# Altium project HeadControllerATMEL.PrjPcb
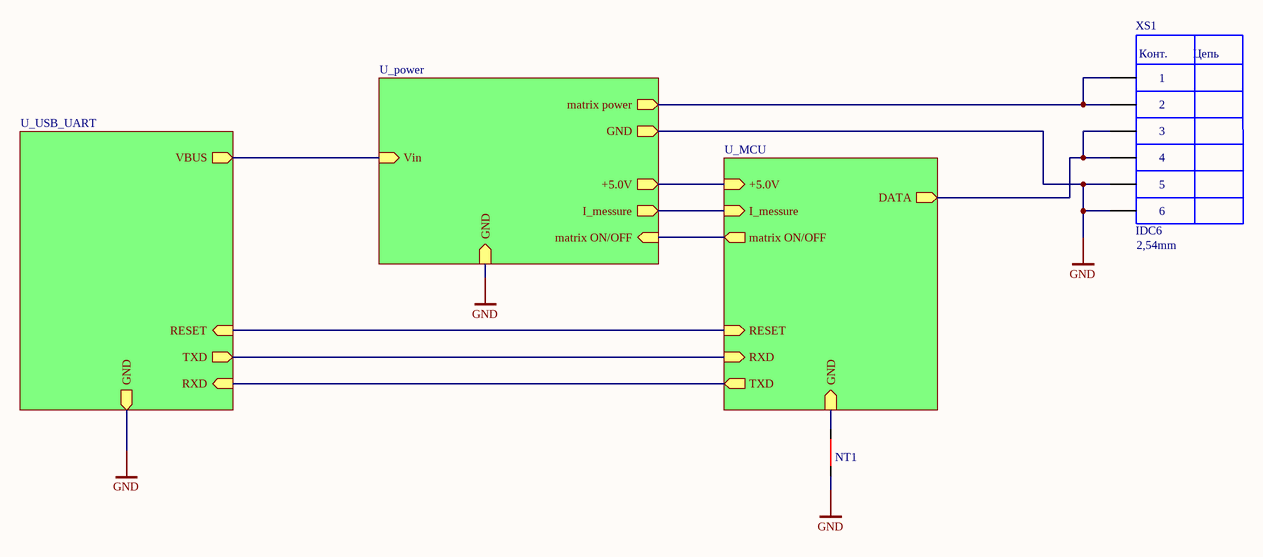
[diagram p0: HeadController.SchDoc]
4 sheets, 64 parts. Net scope: hierarchical (ports join the sheet entries above them; power ports are global).
Board file: HeadControllerATMEL_1.PcbDoc
Sheets:
  HeadController.SchDoc
    U_MCU = MCU.SchDoc
    U_power = power.SchDoc
    U_USB_UART = USB_UART.SchDoc

## Sheet HeadController.SchDoc
size A4

### Parts
NT1  (no value)  [NT]  (net tie, no BOM)
XS1  IDC6  Package: 2,54mm  [IDC-6 (2.54) (end face)]

### Sub-sheets
U_MCU = MCU.SchDoc: GND (in), +5.0V (in), RXD (in), TXD (out), I_messure (in), matrix ON/OFF (out), DATA (out), RESET (in)
U_power = power.SchDoc: +5.0V (out), Vin (in), I_messure (out), matrix ON/OFF (in), matrix power (out), GND (out), GND (in)
U_USB_UART = USB_UART.SchDoc: TXD (out), RXD (in), VBUS (out), GND (out), RESET (in)

### Nets
GND: NT1.2 XS1.5 XS1.6 ; sheet U_power/GND, sheet U_power/GND, sheet U_USB_UART/GND
MCU_GND: NT1.1 ; sheet U_MCU/GND
MCU_VCC: sheet U_MCU/+5.0V, sheet U_power/+5.0V
VBUS: sheet U_power/Vin, sheet U_USB_UART/VBUS
M_ON/OFF: sheet U_MCU/matrix ON/OFF, sheet U_power/matrix ON/OFF
NetC5_2: sheet U_MCU/RESET, sheet U_USB_UART/RESET
NetDD1_23: sheet U_MCU/I_messure, sheet U_power/I_messure
NetDD1_30: sheet U_MCU/RXD, sheet U_USB_UART/TXD
NetDD1_31: sheet U_MCU/TXD, sheet U_USB_UART/RXD
NetR20_2: XS1.3 XS1.4 ; sheet U_MCU/DATA
NetVT2_3: XS1.1 XS1.2 ; sheet U_power/matrix power

### Notes on the sheet
- (in symbol IDC6) Конт.; Цепь

### Library data of the parts
NT1 = NT
XS1 = IDC6: ValueBOM: Разъём IDC6 прямой; Type: XS; Value: IDC6

## Sheet MCU.SchDoc
size A3
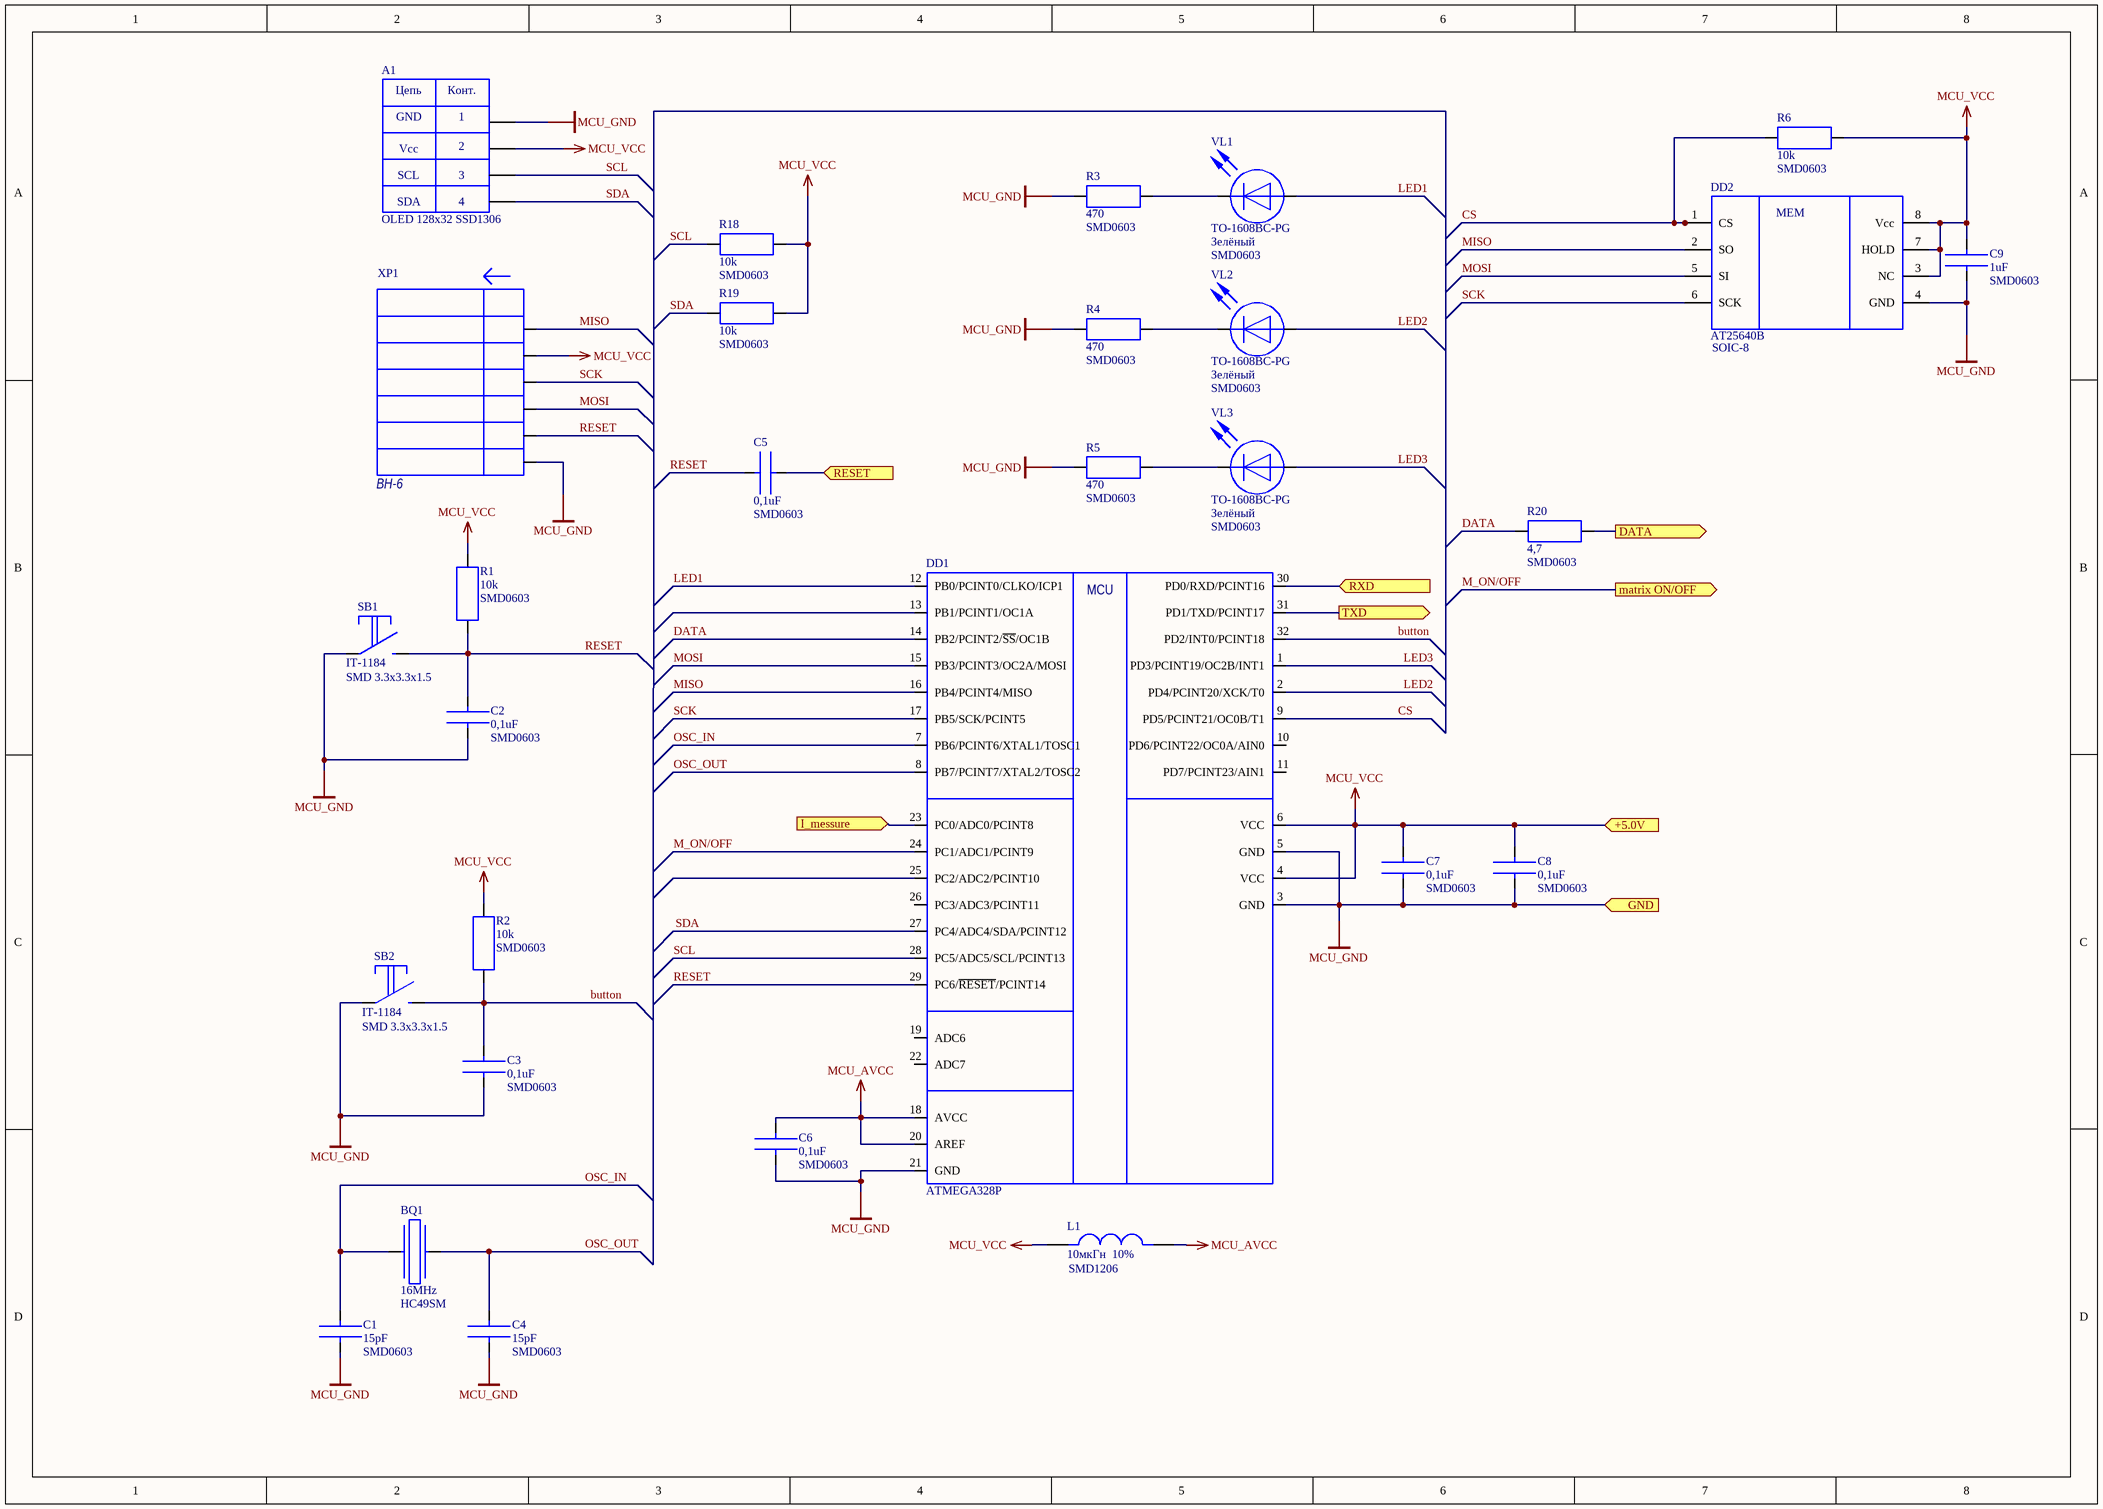
[diagram p1: MCU.SchDoc]

### Parts
A1  OLED 128x32 SSD1306  [OLED 128x32]
BQ1  16МHz  Package: HC49SM  [BQ_HC49SM]
C1  15pF  Package: SMD0603  [SMD0603(1005)]
C2  0,1uF  Package: SMD0603  [SMD0603(1005)]
C3  0,1uF  Package: SMD0603  [SMD0603(1005)]
C4  15pF  Package: SMD0603  [SMD0603(1005)]
C5  0,1uF  Package: SMD0603  [SMD0603(1005)]
C6  0,1uF  Package: SMD0603  [SMD0603(1005)]
C7  0,1uF  Package: SMD0603  [SMD0603(1005)]
C8  0,1uF  Package: SMD0603  [SMD0603(1005)]
C9  1uF  Package: SMD0603  [SMD0603(1005)]
DD1  ATMEGA328P  [TQFP-32]
DD2  AT25640B  Package: SOIC-8  [SOIC8]
L1  10мкГн  10%  Package: SMD1206  [SMD1206(3216)]
R1  10k  Package: SMD0603  [SMD0603(1005)]
R2  10k  Package: SMD0603  [SMD0603(1005)]
R3  470  Package: SMD0603  [SMD0603(1005)]
R4  470  Package: SMD0603  [SMD0603(1005)]
R5  470  Package: SMD0603  [SMD0603(1005)]
R6  10k  Package: SMD0603  [SMD0603(1005)]
R18  10k  Package: SMD0603  [SMD0603(1005)]
R19  10k  Package: SMD0603  [SMD0603(1005)]
R20  4,7  Package: SMD0603  [SMD0603(1005)]
SB1  IT-1184  Package: SMD 3.3x3.3x1.5  [IT-1184]
SB2  IT-1184  Package: SMD 3.3x3.3x1.5  [IT-1184]
VL1  TO-1608BC-PG  Light: Зелёный  Package: SMD0603  [LED_SMD0603(1005)]
VL2  TO-1608BC-PG  Light: Зелёный  Package: SMD0603  [LED_SMD0603(1005)]
VL3  TO-1608BC-PG  Light: Зелёный  Package: SMD0603  [LED_SMD0603(1005)]
XP1  BH-6  [IDC-6 (2.54)]

### Ports
+5.0V (in), DATA (out), GND (in), I_messure (in), matrix ON/OFF (out), RESET (in), RXD (in), TXD (out)

### Nets
MCU_AVCC: C6.1 DD1.18(AVCC) DD1.20(AREF) L1.2(IN1)
MCU_GND: A1.1(+5) C1.1 C2.2 C3.2 C4.1 C6.2 C7.2 C8.1 C9.2 DD1.3(GND) DD1.5(GND) DD1.21(GND) DD2.4(GND) R3.2 R4.2 R5.2 SB1.1 SB2.1 XP1.6 ; port GND
MCU_VCC: A1.2(DM-) C7.1 C8.2 C9.1 DD1.4(VCC) DD1.6(VCC) DD2.3(NC) DD2.7(HOLD) DD2.8(Vcc) L1.1(IN1) R1.2 R2.2 R6.2 R18.1 R19.1 XP1.2 ; port +5.0V
button: C3.1 DD1.32(PD2/INT0/PCINT18) R2.1 SB2.2
CS: DD1.9(PD5/PCINT21/OC0B/T1) DD2.1(CS) R6.1
DATA: DD1.14(PB2/PCINT2/~{SS}/OC1B) R20.1
LED1: DD1.12(PB0/PCINT0/CLKO/ICP1) VL1.1
LED2: DD1.2(PD4/PCINT20/XCK/T0) VL2.1
LED3: DD1.1(PD3/PCINT19/OC2B/INT1) VL3.1
M_ON/OFF: DD1.24(PC1/ADC1/PCINT9) ; port matrix ON/OFF
MISO: DD1.16(PB4/PCINT4/MISO) DD2.2(SO) XP1.1
MOSI: DD1.15(PB3/PCINT3/OC2A/MOSI) DD2.5(SI) XP1.4
OSC_IN: BQ1.1 C1.2 DD1.7(PB6/PCINT6/XTAL1/TOSC1)
OSC_OUT: BQ1.2 C4.2 DD1.8(PB7/PCINT7/XTAL2/TOSC2)
RESET: C2.1 C5.1 DD1.29(PC6/~{RESET}/PCINT14) R1.1 SB1.2 XP1.5
SCK: DD1.17(PB5/SCK/PCINT5) DD2.6(SCK) XP1.3
SCL: A1.3(DM-) DD1.28(PC5/ADC5/SCL/PCINT13) R18.2
SDA: A1.4(DM-) DD1.27(PC4/ADC4/SDA/PCINT12) R19.2
NetC5_2: C5.2 ; port RESET
NetDD1_23: DD1.23(PC0/ADC0/PCINT8) ; port I_messure
NetDD1_30: DD1.30(PD0/RXD/PCINT16) ; port RXD
NetDD1_31: DD1.31(PD1/TXD/PCINT17) ; port TXD
NetR3_1: R3.1 VL1.2
NetR4_1: R4.1 VL2.2
NetR5_1: R5.1 VL3.2
NetR20_2: R20.2 ; port DATA

Not connected (* = marked no-connect by the designer): DD1 10(PD6/PCINT22/OC0A/AIN0) 11(PD7/PCINT23/AIN1) 13(PB1/PCINT1/OC1A) 19(ADC6) 22(ADC7) 25(PC2/ADC2/PCINT10) 26(PC3/ADC3/PCINT11)

### Notes on the sheet
- Title
- Size:
- Date:
- A3
- Number:
- Time:
- Revision:
- Sheet
- of
- File:
- (in symbol ATMEGA168V-10AU) MCU
- (in symbol OLED) Цепь; Конт.; GND; Vcc; SCL; SDA
- (in symbol Микросхема AT25640B) MEM

### Library data of the parts
A1 = OLED: ValueBOM: Дисплей OLED-дисплей 0.91-дюймовый, белый, ЖК дисплей 128 * 32, на SSD1306, модуль для Arduino, интерфейс I2C IIC; Type: A; Value: OLED 128x32 SSD1306
BQ1 = BQ_HC49SM: ValueBOM: Кварцевый резонатор 16МГц HC49S; Type: BQ; Value: 16МHz
C1 C4 = CER_CUP_0603: Type: C; ValueBOM: Конденсатор керамический 15пФ SMD 0603 1%; Value: 15pF
C2 C3 C5-C8 = CER_CUP_0603: Type: C; ValueBOM: Конденсатор керамический 0,1мкФ SMD 0603 1%; Value: 0,1uF
C9 = CER_CUP_0603: Type: C; ValueBOM: Конденсатор керамический 1мкФ SMD 0603 1%; Value: 1uF
DD1 = ATMEGA168V-10AU: Microcontroller; Vendor: Atmel; ValueBOM: Микроконтроллер ATMEGA328P; GlobalLink: ATMEGA168V-10AU; Type: DD; Value: ATMEGA328P; Vendor P/N: ATMEGA168V-10AU; Package: TQFP-32; Package Description: JEDEC reference MS-026, Variation ABA
DD2 = Микросхема AT25640B: ValueBOM: Микросхема EEPROM AT25640B; Value: AT25640B; Type: DD
L1 = L1: ValueBOM: Индуктивность 10 мкГн, SMD1206, 10%; Type: L; Value: 10мкГн  10%
R1 R2 R6 R18 R19 = R_0603: ValueBOM: Резистор 10кОм SMD 0603 1%; Type: R; Value: 10k
R3-R5 = R_0603: ValueBOM: Резистор 470 Ом SMD 0603 1%; Type: R; Value: 470
R20 = R_0603: ValueBOM: Резистор 4,7Ом SMD 0603 1%; Type: R; Value: 4,7
SB1 SB2 = Кнопка тактовая (универсальная): ValueBOM: Кнопка тактовая IT1184; Type: SB; Value: IT-1184
VL1-VL3 = LED_0603: ValueBOM: Светодиод зелёный TO-1608BC-PG SMD0603; Type: VL; Value: TO-1608BC-PG
XP1 = ISP_HEADER: ValueBOM: Разъем BH-6 вилка 6 контактов (2х3), на плату, шаг 2.54мм; GlobalLink: ISP_HEADER; Type: XP; Value: BH-6; Package: DIL-6

## Sheet power.SchDoc
size A4
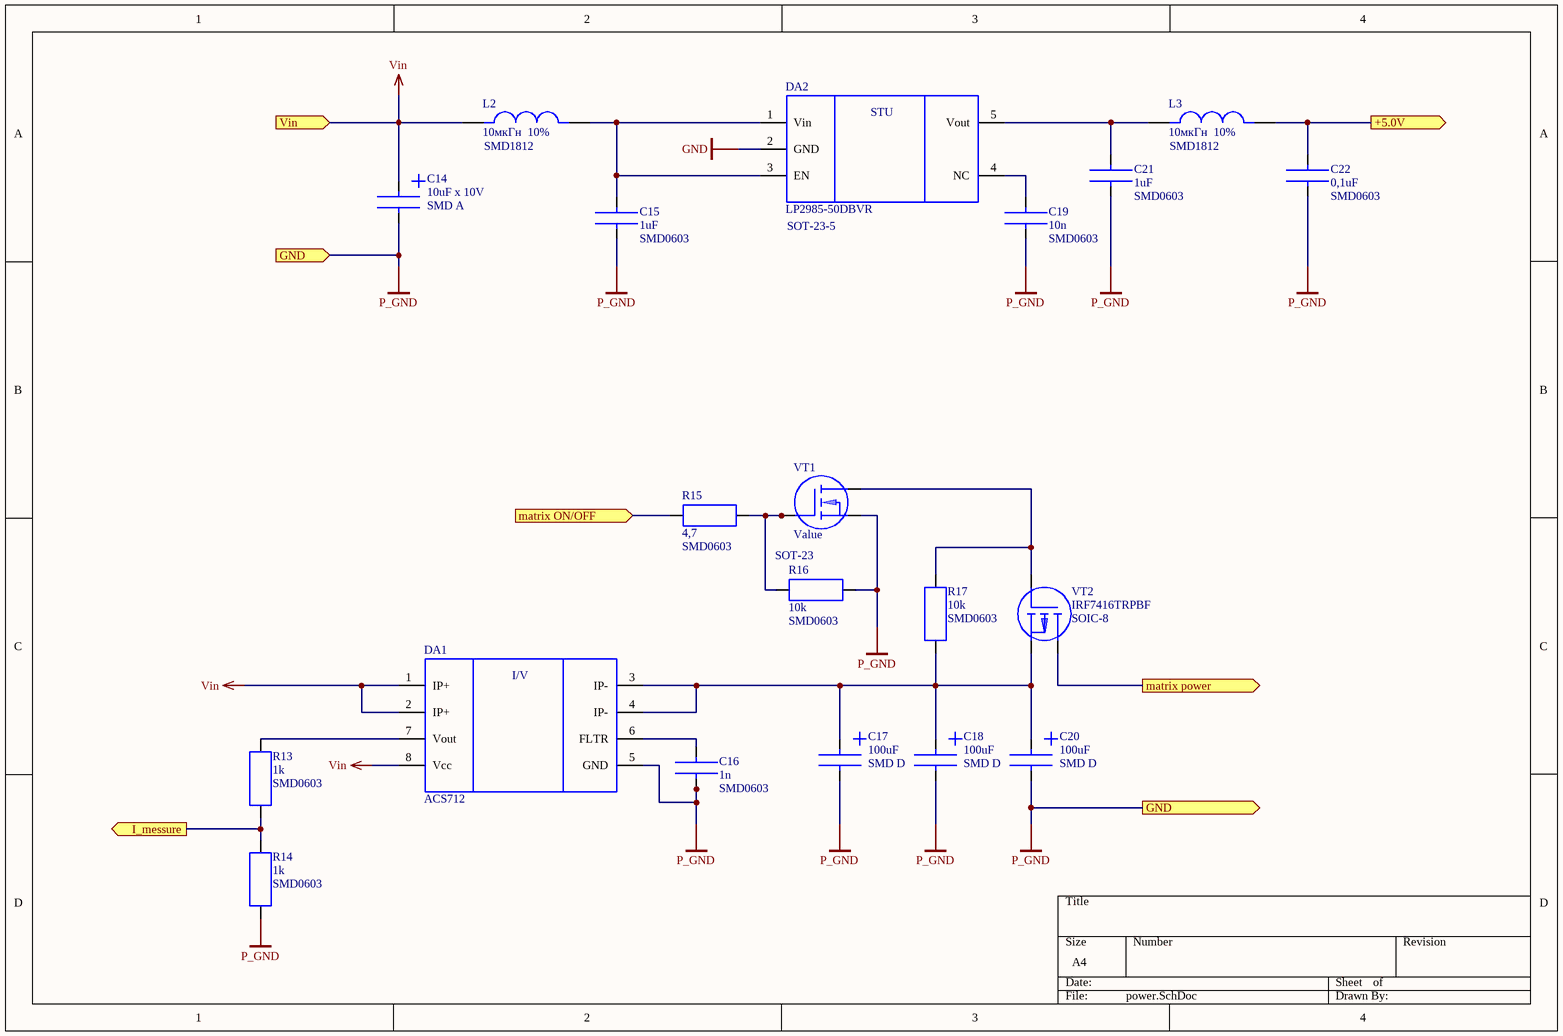
[diagram p2: power.SchDoc]

### Parts
C14  10uF x 10V  Package: SMD A  [TANT_CAP_A(3216)]
C15  1uF  Package: SMD0603  [SMD0603(1005)]
C16  1n  Package: SMD0603  [SMD0603(1005)]
C17  100uF  Package: SMD D  [TANT_CAP_D(7343)]
C18  100uF  Package: SMD D  [TANT_CAP_D(7343)]
C19  10n  Package: SMD0603  [SMD0603(1005)]
C20  100uF  Package: SMD D  [TANT_CAP_D(7343)]
C21  1uF  Package: SMD0603  [SMD0603(1005)]
C22  0,1uF  Package: SMD0603  [SMD0603(1005)]
DA1  ACS712  [SOIC8]
DA2  LP2985-50DBVR  Package: SOT-23-5  [SOT23-5]
L2  10мкГн  10%  Package: SMD1812  [SMD2010(5025)]
L3  10мкГн  10%  Package: SMD1812  [SMD2010(5025)]
R13  1k  Package: SMD0603  [SMD0603(1005)]
R14  1k  Package: SMD0603  [SMD0603(1005)]
R15  4,7  Package: SMD0603  [SMD0603(1005)]
R16  10k  Package: SMD0603  [SMD0603(1005)]
R17  10k  Package: SMD0603  [SMD0603(1005)]
VT1  Value  Package: SOT-23  [SOT23-3]
VT2  IRF7416TRPBF  Package: SOIC-8  [VT_SOIC8]

### Ports
+5.0V (out), GND (in), GND (out), I_messure (out), matrix ON/OFF (in), matrix power (out), Vin (in)

### Nets
GND: C14.2 C15.2 C16.2 C17.2 C18.2 C19.2 C20.2 C21.2 C22.2 DA1.5(GND) DA2.2(GND) R14.2 R16.2 VT1.2 ; port GND  [also labelled P_GND]
MCU_VCC: C22.1 L3.2(IN1) ; port +5.0V
Vin: C14.1 DA1.1(IP+) DA1.2(IP+) DA1.8(Vcc) L2.1(IN1) ; port Vin  [project net VBUS]
M_ON/OFF: R15.1 ; port matrix ON/OFF
NetC15_1: C15.1 DA2.1(Vin) DA2.3(EN) L2.2(IN1)
NetC16_1: C16.1 DA1.6(FLTR)
NetC17_1: C17.1 C18.1 C20.1 DA1.3(IP-) DA1.4(IP-) R17.2 VT2.1
NetC19_1: C19.1 DA2.4(NC)
NetC21_1: C21.1 DA2.5(Vout) L3.1(IN1)
NetDA1_7: DA1.7(Vout) R13.1
NetDD1_23: R13.2 R14.1 ; port I_messure
NetR15_2: R15.2 R16.1 VT1.1
NetR17_1: R17.1 VT1.3 VT2.2
NetVT2_3: VT2.3 ; port matrix power

### Notes on the sheet
- (in symbol LD3985M33R) STU
- (in symbol Микросхема ACS712) I/V

### Library data of the parts
C14 = C_TANT_A: Type: C; ValueBOM: Конденсатор танталовый 10мкФ х 10В SMD A; Value: 10uF x 10V
C15 C21 = CER_CUP_0603: as C9 on sheet MCU; Value: 1uF
C16 = CER_CUP_0603: Type: C; ValueBOM: Конденсатор керамический 1нФ х 50В SMD 0603 1%; Value: 1n
C17 C18 C20 = C_TANT_D: Type: C; ValueBOM: Конденсатор танталовый 100мкФ х 16В 10%  SMD D; Value: 100uF
C19 = CER_CUP_0603: Type: C; ValueBOM: Конденсатор керамический 10нФ х 50В SMD 0603 1%; Value: 10n
C22 = CER_CUP_0603: as C2 on sheet MCU; Value: 0,1uF
DA1 = Микросхема ACS712: Value: ACS712; Type: DA; ValueBOM: Микросхема ACS712
DA2 = LD3985M33R: ValueBOM: Микросхема LP2985-50DBVR, SOT-23-5; Value: LP2985-50DBVR; Type: DA
L2 L3 = L1: ValueBOM: Индуктивность B82432-C1103-K, 10 мкГн, SMD1812, 10%; Type: L; Value: 10мкГн  10%
R13 R14 = R_0603: ValueBOM: Резистор 1кОм SMD 0603 1%; Type: R; Value: 1k
R15 = R_0603: ValueBOM: Резистор 4,7Ом SMD 0603 1%; Type: R; Value: 4,7
R16 R17 = R_0603: ValueBOM: Резистор 10кОм SMD 0603 1%; Type: R; Value: 10k
VT1 = VT_N_MOSFET_SOT23_3: Type: VT; ValueBOM: Транзистор n-МОП Value SOT23; Value: Value
VT2 = Транзистор IRF7416TRPBF: Type: VT; ValueBOM: Транзистор p-МОП IRF7416TRPBF, SOIC-8; Value: IRF7416TRPBF

## Sheet USB_UART.SchDoc
size A4
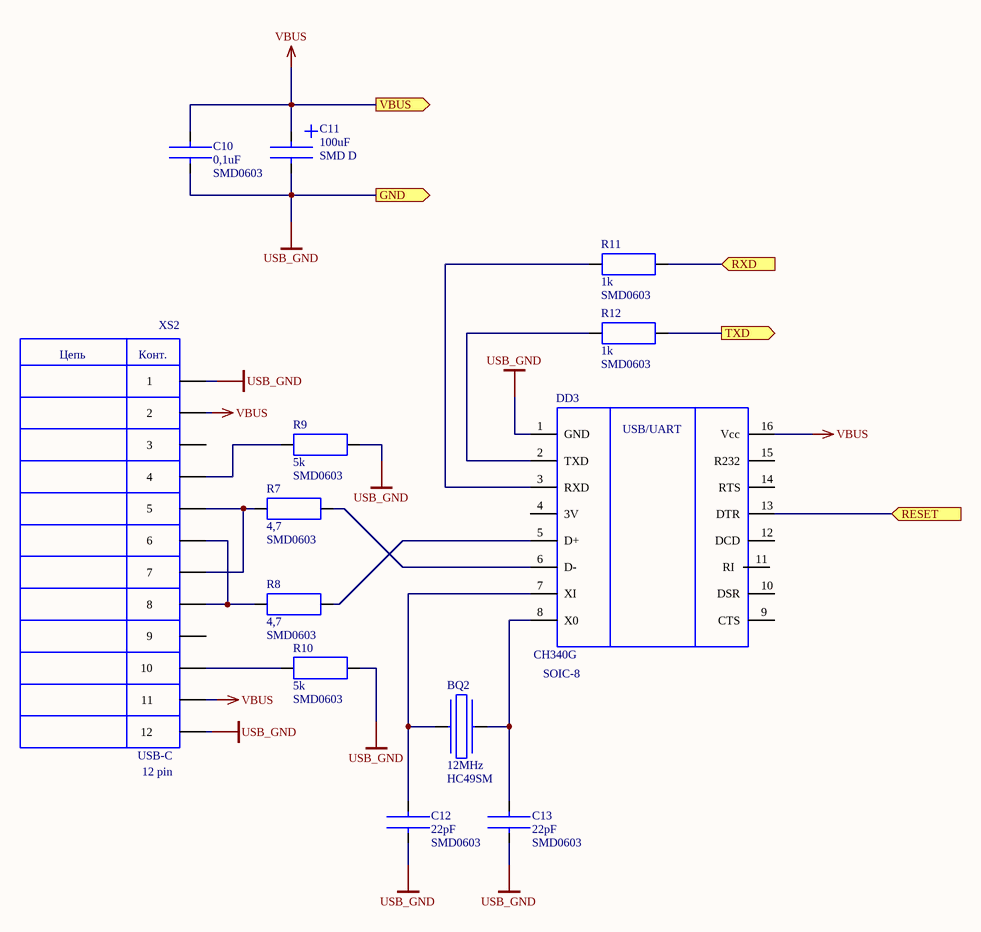
[diagram p3: USB_UART.SchDoc]

### Parts
BQ2  12МHz  Package: HC49SM  [BQ_HC49SM]
C10  0,1uF  Package: SMD0603  [SMD0603(1005)]
C11  100uF  Package: SMD D  [TANT_CAP_D(7343)]
C12  22pF  Package: SMD0603  [SMD0603(1005)]
C13  22pF  Package: SMD0603  [SMD0603(1005)]
DD3  CH340G  Package: SOIC-8  [SOIC16]
R7  4,7  Package: SMD0603  [SMD0603(1005)]
R8  4,7  Package: SMD0603  [SMD0603(1005)]
R9  5k  Package: SMD0603  [SMD0603(1005)]
R10  5k  Package: SMD0603  [SMD0603(1005)]
R11  1k  Package: SMD0603  [SMD0603(1005)]
R12  1k  Package: SMD0603  [SMD0603(1005)]
XS2  USB-C  Package: 12 pin  [USB_C]

### Ports
GND (out), RESET (in), RXD (in), TXD (out), VBUS (out)

### Nets
USB_GND: C10.1 C11.2 C12.1 C13.1 DD3.1(GND) R9.1 R10.1 XS2.1 XS2.12 ; port GND  [project net GND]
VBUS: C10.2 C11.1 DD3.16(Vcc) XS2.2 XS2.11 ; port VBUS
NetBQ2_1: BQ2.1 C12.2 DD3.7(XI)
NetBQ2_2: BQ2.2 C13.2 DD3.8(X0)
NetC5_2: DD3.13(DTR) ; port RESET
NetDD1_30: R12.1 ; port TXD
NetDD1_31: R11.1 ; port RXD
NetDD3_2: DD3.2(TXD) R12.2
NetDD3_3: DD3.3(RXD) R11.2
NetDD3_5: DD3.5(D+) R8.2
NetDD3_6: DD3.6(D-) R7.2
NetR7_1: R7.1 XS2.5 XS2.7
NetR8_1: R8.1 XS2.6 XS2.8
NetR9_2: R9.2 XS2.4
NetR10_2: R10.2 XS2.10

Not connected (* = marked no-connect by the designer): DD3 4(3V) 9(CTS) 10(DSR) 11(RI) 12(DCD) 14(RTS) 15(R232); XS2 3 9

### Notes on the sheet
- (in symbol USB_C) Цепь; Конт.
- (in symbol Микросхема CH340G) USB/UART

### Library data of the parts
BQ2 = BQ_HC49SM: ValueBOM: Кварцевый резонатор 12МГц HC49S; Type: BQ; Value: 12МHz
C10 = CER_CUP_0603: as C2 on sheet MCU; Value: 0,1uF
C11 = C_TANT_D: as C17 on sheet power; Value: 100uF
C12 C13 = CER_CUP_0603: Type: C; ValueBOM: Конденсатор керамический 22пФ SMD 0603 1%; Value: 22pF
DD3 = Микросхема CH340G: Type: DD; Value: CH340G; ValueBOM: Микросхема CH340G
R7 R8 = R_0603: ValueBOM: Резистор 4,7Ом SMD 0603 1%; Type: R; Value: 4,7
R9 R10 = R_0603: ValueBOM: Резистор 5кОм SMD 0603 1%; Type: R; Value: 5k
R11 R12 = R_0603: ValueBOM: Резистор 1кОм SMD 0603 1%; Type: R; Value: 1k
XS2 = USB_C: ValueBOM: Разъём USB type C 12 контактный; Value: USB-C; Type: XS; Link: https://www.voltmaster-samara.ru/upload/iblock/68a/68a6841d20080b30588d6f36d0bc1a38.pdf

## Nets that join several sheets
GND: HeadController (NT1.2 XS1.5 XS1.6), power (14 pins), USB_UART (9 pins)
MCU_GND: HeadController (NT1.1), MCU (19 pins)
MCU_VCC: MCU (16 pins), power (C22.1 L3.2)
VBUS: power (5 pins), USB_UART (5 pins)
M_ON/OFF: MCU (DD1.24), power (R15.1)
NetC5_2: MCU (C5.2), USB_UART (DD3.13)
NetDD1_23: MCU (DD1.23), power (R13.2 R14.1)
NetDD1_30: MCU (DD1.30), USB_UART (R12.1)
NetDD1_31: MCU (DD1.31), USB_UART (R11.1)
NetR20_2: HeadController (XS1.3 XS1.4), MCU (R20.2)
NetVT2_3: HeadController (XS1.1 XS1.2), power (VT2.3)